# EAGLE design led_ausgabe (EAGLE 4.15)
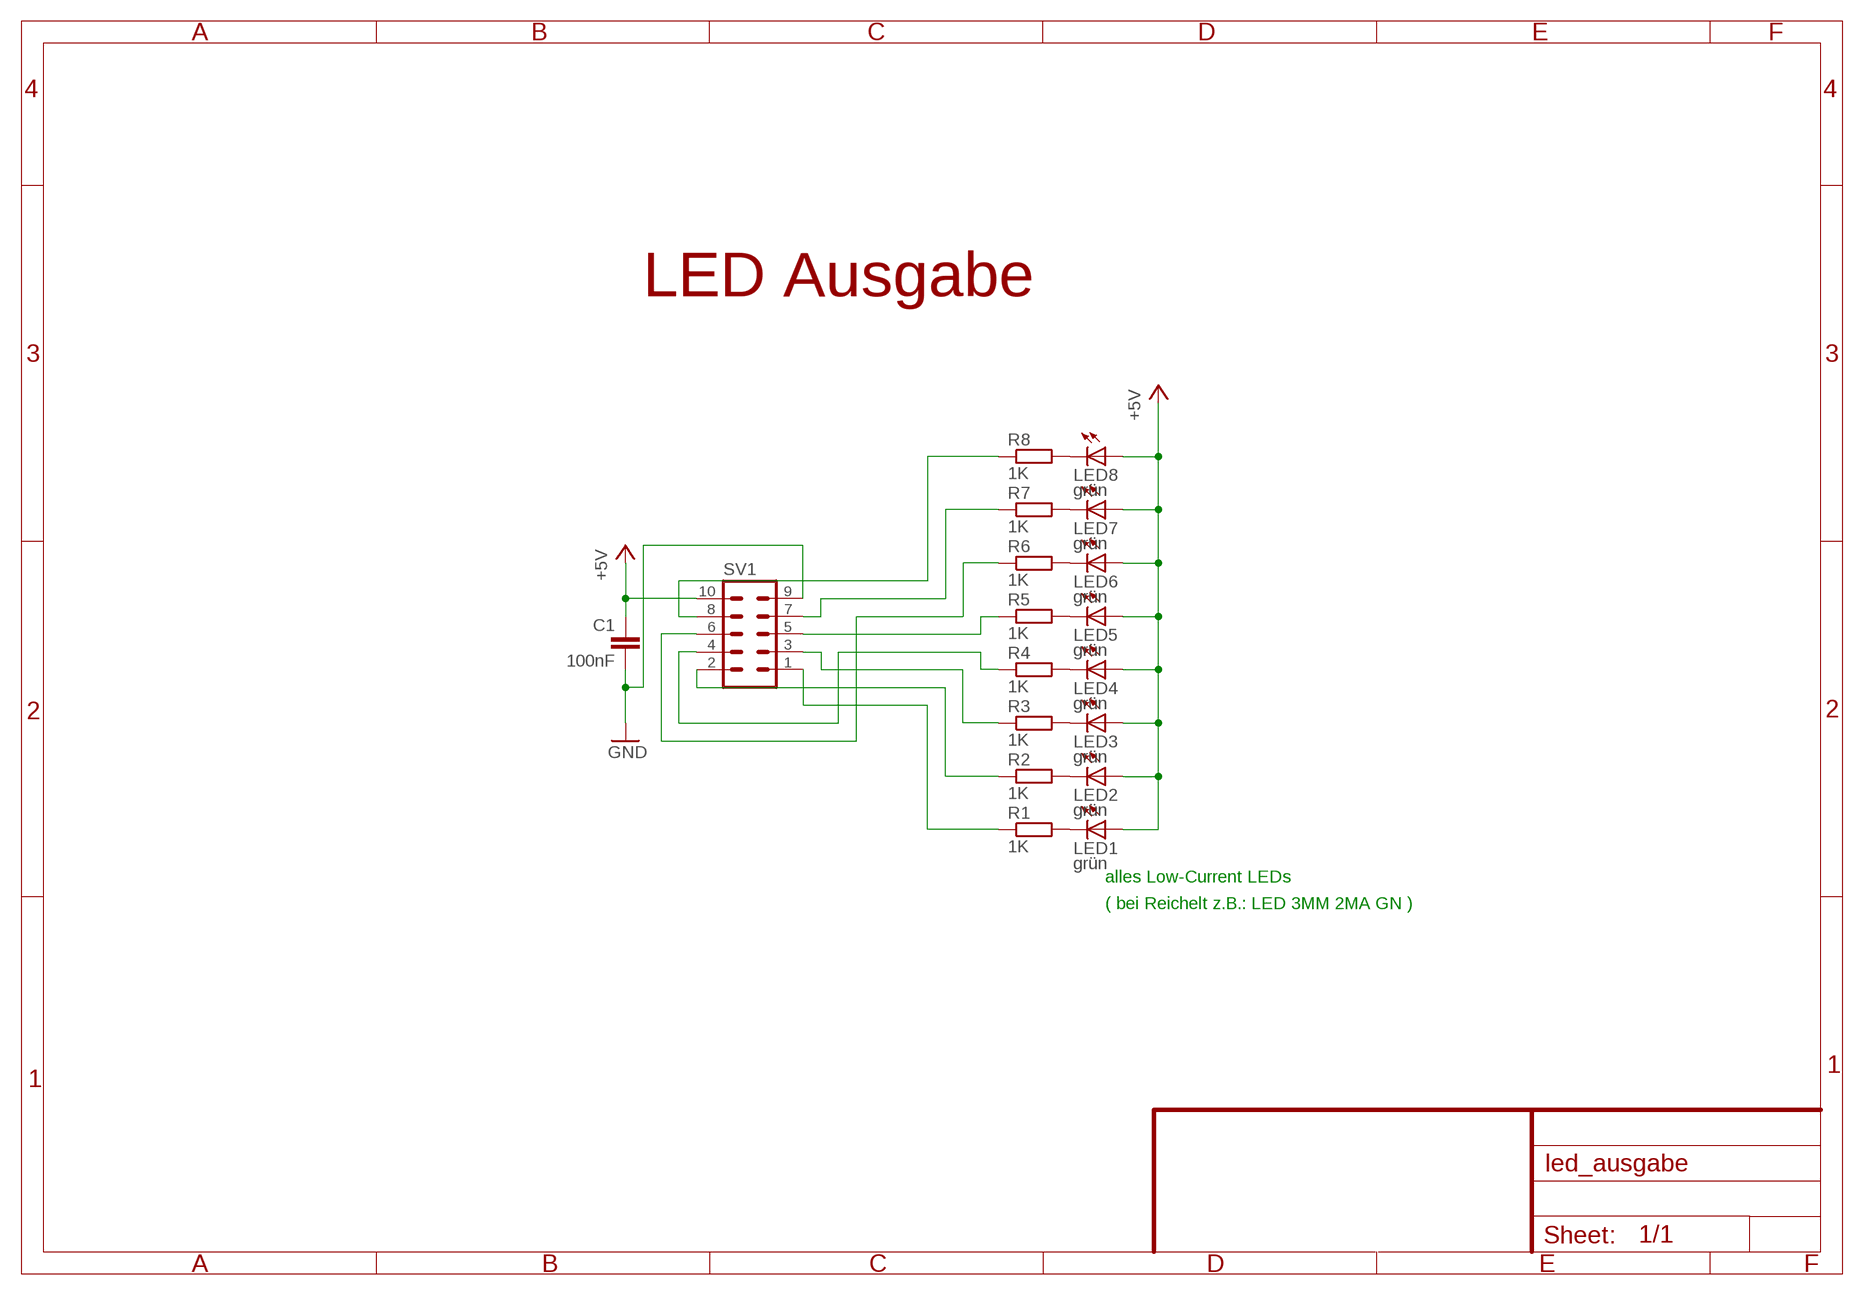
[diagram p0: schematic, sheet 1]

## Parts
C1  100nF  C-EU025-024X044  [C025-024X044]
LED1  grün  LED3MM  [LED3MM]
LED2  grün  LED3MM  [LED3MM]
LED3  grün  LED3MM  [LED3MM]
LED4  grün  LED3MM  [LED3MM]
LED5  grün  LED3MM  [LED3MM]
LED6  grün  LED3MM  [LED3MM]
LED7  grün  LED3MM  [LED3MM]
LED8  grün  LED3MM  [LED3MM]
R1  1K  R-EU_0207/7  [0207/7]
R2  1K  R-EU_0207/7  [0207/7]
R3  1K  R-EU_0207/7  [0207/7]
R4  1K  R-EU_0207/7  [0207/7]
R5  1K  R-EU_0207/7  [0207/7]
R6  1K  R-EU_0207/7  [0207/7]
R7  1K  R-EU_0207/7  [0207/7]
R8  1K  R-EU_0207/7  [0207/7]
SV1  ML10  [ML10]

## Nets
+5V: C1.1 LED1.A LED2.A LED3.A LED4.A LED5.A LED6.A LED7.A LED8.A SV1.10
GND: C1.2 SV1.9
N$1: LED1.K(C) R1.2
N$2: LED2.K(C) R2.2
N$3: LED3.K(C) R3.2
N$4: LED4.K(C) R4.2
N$5: LED5.K(C) R5.2
N$6: LED6.K(C) R6.2
N$7: LED7.K(C) R7.2
N$8: LED8.K(C) R8.2
N$9: R5.1 SV1.5
N$10: R4.1 SV1.4
N$11: R3.1 SV1.3
N$12: R2.1 SV1.2
N$13: R1.1 SV1.1
N$14: R6.1 SV1.6
N$15: R7.1 SV1.7
N$16: R8.1 SV1.8

## Notes on the sheet
- LED Ausgabe
- alles Low-Current LEDs
- ( bei Reichelt z.B.: LED 3MM 2MA GN )

## Library data of the parts
C1 = rcl:C-EU: CAPACITOR, European symbol
LED1-LED8 = led:LED: LED OSRAM: - CHIPLED LG R971, LG N971, LY N971, LG Q971, LY Q971, LO R971, LY R971 LH N974, LH R974 LS Q976, LO Q976, LY Q976 LO Q996 - Hyper CHIPLED LW Q18S LB Q993, LB Q99A, LB R99A - SideLED LS A670, LO A670, LY A670, LG A670, LP A670 LB A673, LV A673, LT A673, LW A673 LH A674 LY A675 LS A676, LA A676, LO A676, LY A676, LW A676 LS A679, LY A679, LG A679 - Hyper Micro SIDELED® LS Y876, LA Y876, LO Y876, LY Y876 LT Y87S - SmartLED LW L88C, LW L88S LB L89C, LB L89S, LG L890 LS L89K, LO L89K, LY L89K LS L896, LA L896, LO L896, LY L896 - TOPLED LS T670, LO T670, LY T670, LG T670, LP T670 LSG T670, LSP T670, LSY T670, LOP T670, LYG T670 LG T671, LOG T671, LSG T671 LB T673, LV T673, LT T673, LW T673 LH T674 LS T676, LA T676, LO T676, LY T676, LB T676, LH T676, LSB T676, LW T676 LB T67C, LV T67C, LT T67C, LS T67K, LO T67K, LY T67K, LW E67C LS E67B, LA E67B, LO E67B, LY E67B, LB E67C, LV E67C, LT E67C LW T67C LS T679, LY T679, LG T679 LS T770, LO T770, LY T770, LG T770, LP T770 LB T773, LV T773, LT T773, LW T773 LH T774 LS E675, LA E675, LY E675, LS T675 LS T776, LA T776, LO T776, LY T776, LB T776 LHGB T686 LT T68C, LB T68C - Hyper Mini TOPLED® LB M676 - Mini TOPLED Santana® LG M470 LS M47K, LO M47K, LY M47K Source: http://www.osram.convergy.de/
R1-R8 = rcl:R-EU_: RESISTOR, European symbol
SV1 = con-harting-ml:ML10: HARTING

## Board
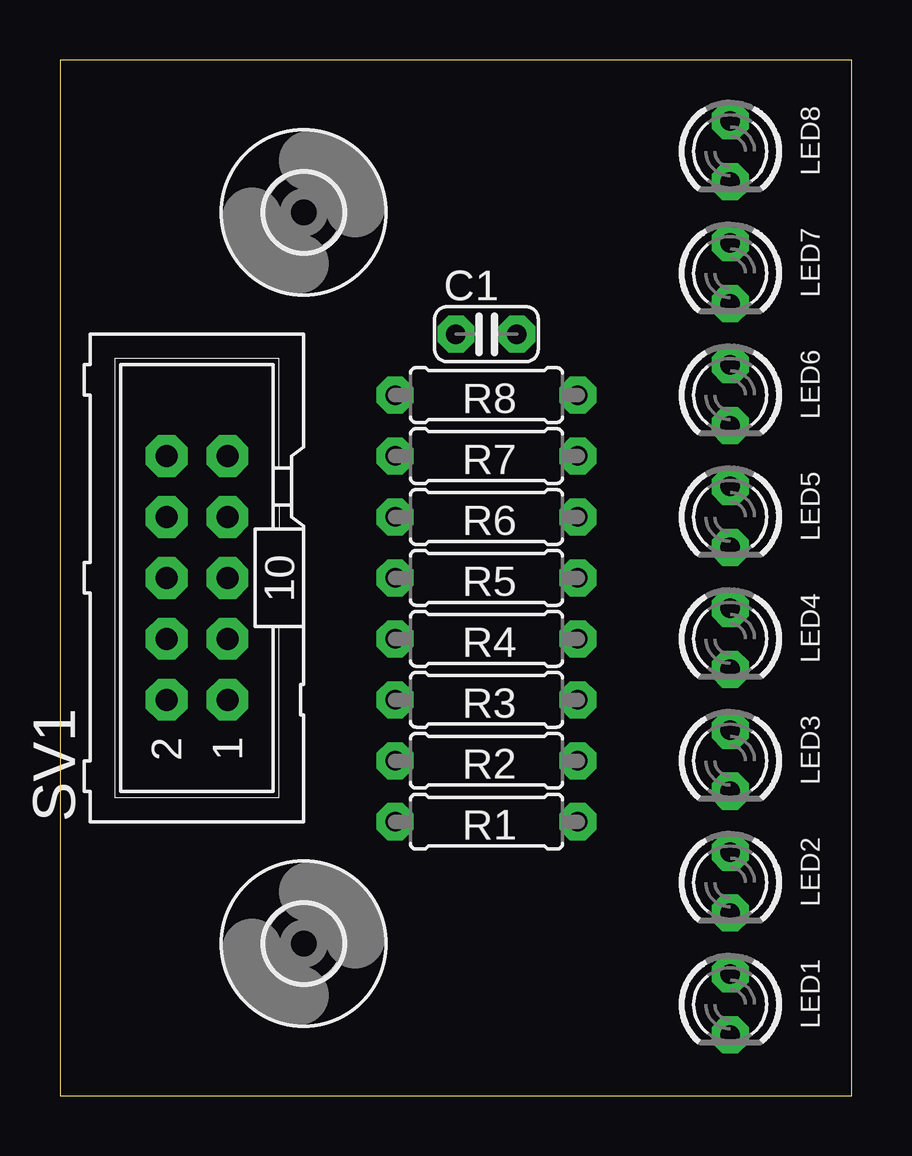
[diagram p1: board, top side]
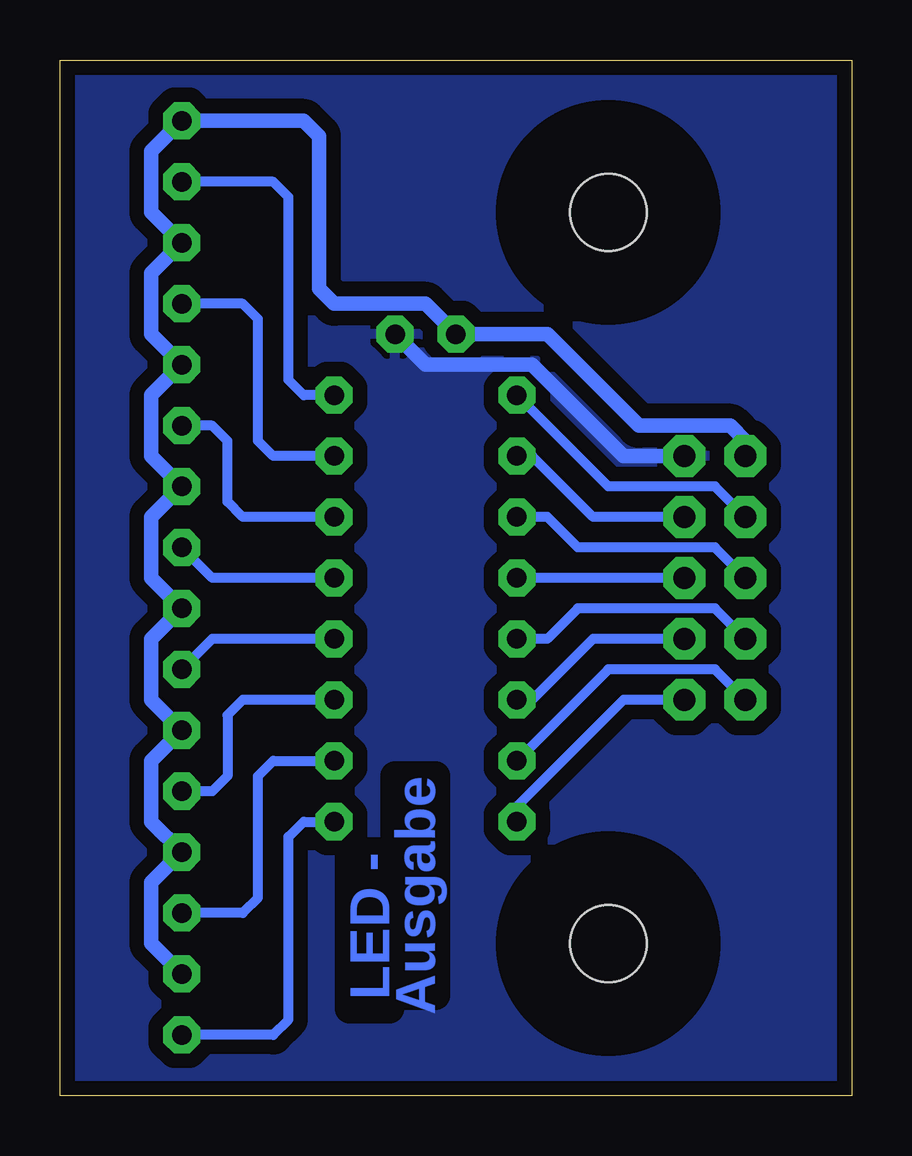
[diagram p2: board, bottom side, seen from below]

Size 33.02 x 43.18 mm. Coordinates in mm from the lower left corner, seen from the top.
Outline: 0,0 33.02,0 33.02,43.18 0,43.18 0,0
Copper layers (1*16): Top 0.035mm / dielectric 1.5mm / Bottom 0.035mm
Design rules "default": minimum track width 10mil, minimum drill 1mm, track to track 8mil, track to pad 8mil, pad to pad 8mil, via to via 8mil, smd to smd 8mil, copper to edge 20mil, drill to drill 8mil, minimum pad ring 10mil, minimum via ring 8mil, stop-mask expansion 4mil, vias tented up to drill 0mil, thermal gap 10mil

### Footprints (pad centres in the part's own frame; a part is rotated, then mirrored left to right if it is on the bottom)
C025-024X044 = drill 0.813 octagon: 1 -1.27,0; 2 1.27,0
LED3MM = drill 0.813 octagon: A -1.27,0; K 1.27,0
0207/7 = drill 0.813 octagon: 1 -3.81,0; 2 3.81,0
ML10 = drill 0.914 octagon: 1 -5.08,-1.27; 2 -5.08,1.27; 3 -2.54,-1.27; 4 -2.54,1.27; 5 0,-1.27; 6 0,1.27; 7 2.54,-1.27; 8 2.54,1.27; 9 5.08,-1.27; 10 5.08,1.27
3,2 = hole 3.2: 0,0

### Placement (x,y rotation side)
C1  17.78,31.75 0 top
LED1  27.94,3.81 270 top
LED2  27.94,8.89 270 top
LED3  27.94,13.97 270 top
LED4  27.94,19.05 270 top
LED5  27.94,24.13 270 top
LED6  27.94,29.21 270 top
LED7  27.94,34.29 270 top
LED8  27.94,39.37 270 top
R1  17.78,11.43 0 top
R2  17.78,13.97 0 top
R3  17.78,16.51 0 top
R4  17.78,19.05 0 top
R5  17.78,21.59 0 top
R6  17.78,24.13 0 top
R7  17.78,26.67 0 top
R8  17.78,29.21 0 top
SV1  5.71,21.59 90 top
U$2  [3,2]  10.16,6.35 0 top
U$3  [3,2]  10.16,36.83 0 top

### Tracks (layer width: path | path; a pad name or v marks a point on that pad's centre or on a via)
+5V
  Bottom 0.61: LED1.A 29.21,6.35 29.21,8.89 LED2.A 29.21,11.43 29.21,13.97 LED3.A 29.21,16.51 29.21,19.05 LED4.A 29.21,21.59 29.21,24.13 LED5.A 29.21,26.67 29.21,29.21 LED6.A 29.21,31.75 29.21,34.29 LED7.A 29.21,36.83 29.21,39.37 LED8.A 22.86,40.64 22.23,40.01 22.23,33.66 21.59,33.02 17.78,33.02 C1.1 12.7,31.75 8.89,27.94 5.08,27.94 4.45,27.3 SV1.10
GND
  Bottom 0.61: C1.2 17.78,30.48 13.34,30.48 9.53,26.67 SV1.9
  pour Bottom (isolate 0.61): 0,43.18 33.02,43.18 33.02,0 0,0
N$1
  Bottom 0.406: R1.2 22.86,11.43 23.5,10.79 23.5,3.17 24.13,2.54 LED1.K
N$2
  Bottom 0.406: R2.2 24.13,13.97 24.77,13.34 24.77,8.26 25.4,7.62 LED2.K
N$3
  Bottom 0.406: R3.2 25.4,16.51 26.04,15.88 26.04,13.34 26.67,12.7 LED3.K
N$4
  Bottom 0.406: R4.2 26.67,19.05 LED4.K
N$5
  Bottom 0.406: R5.2 26.67,21.59 LED5.K
N$6
  Bottom 0.406: R6.2 25.4,24.13 26.04,24.77 26.04,27.3 26.67,27.94 LED6.K
N$7
  Bottom 0.406: R7.2 24.13,26.67 24.77,27.3 24.77,32.38 25.4,33.02 LED7.K
N$8
  Bottom 0.406: R8.2 22.86,29.21 23.5,29.84 23.5,37.47 24.13,38.1 LED8.K
N$9
  Bottom 0.406: SV1.5 R5.1
N$10
  Bottom 0.406: R4.1 12.7,19.05 11.43,20.32 5.71,20.32 SV1.4
N$11
  Bottom 0.406: R3.1 13.34,16.51 10.79,19.05 SV1.3
N$12
  Bottom 0.406: R2.1 10.16,17.78 5.71,17.78 SV1.2
N$13
  Bottom 0.406: R1.1 13.97,12.06 9.53,16.51 SV1.1
N$14
  Bottom 0.406: R6.1 12.7,24.13 11.43,22.86 5.71,22.86 SV1.6
N$15
  Bottom 0.406: R7.1 13.34,26.67 10.79,24.13 SV1.7
N$16
  Bottom 0.406: R8.1 10.16,25.4 5.71,25.4 SV1.8

### Text on the board
Bottom: Ausgabe | LED -